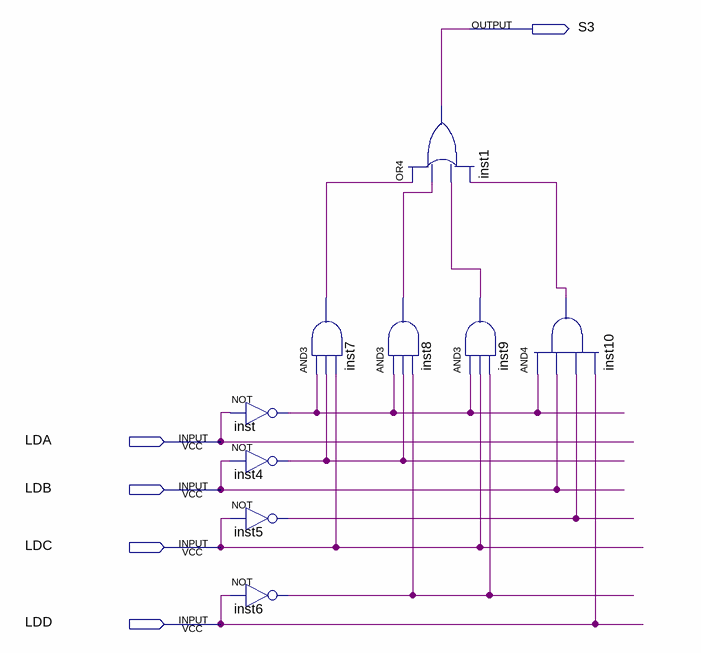
[diagram p0: schematic sheet]
// Quartus schematic Linha3.bdf as structural Verilog: 9 symbols, 5 pins
module Linha3 (
  input  LDA,
  input  LDB,
  input  LDC,
  input  LDD,
  output S3
);

  wire inst4_out, inst5_out, inst6_out, inst7_out, inst8_out, inst9_out, inst10_out, inst_out;

  and inst7 (inst7_out, inst_out, inst4_out, LDC);
  not inst (inst_out, LDA);
  not inst4 (inst4_out, LDB);
  not inst5 (inst5_out, LDC);
  not inst6 (inst6_out, LDD);
  and inst8 (inst8_out, inst_out, inst4_out, inst6_out);
  or inst1 (S3, inst7_out, inst8_out, inst9_out, inst10_out);
  and inst9 (inst9_out, inst_out, LDC, inst6_out);
  and inst10 (inst10_out, inst_out, LDB, inst5_out, LDD);
endmodule
